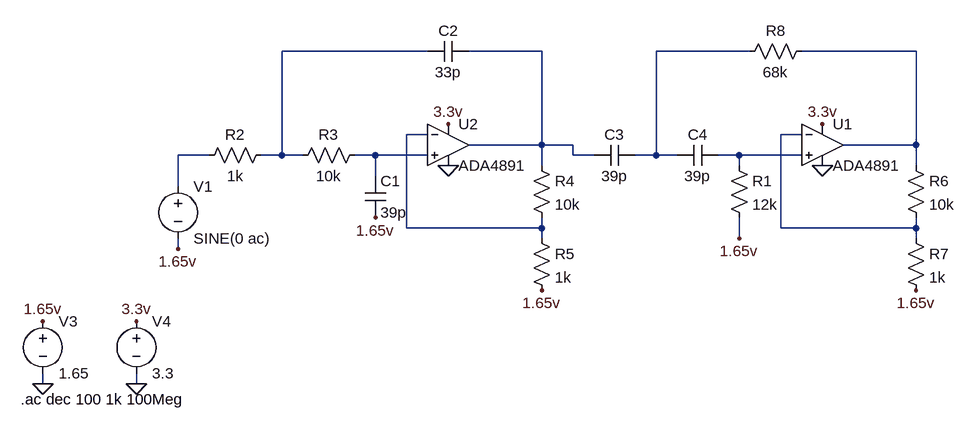
[diagram p0: schematic Draft5.asc]
Draft5.asc, the LTspice schematic file:
Version 4
SHEET 1 1140 680
WIRE 320 -64 96 -64
WIRE 496 -64 384 -64
WIRE 816 -64 672 -64
WIRE 1072 -64 896 -64
WIRE 320 64 288 64
WIRE 896 64 864 64
WIRE 496 80 496 -64
WIRE 496 80 384 80
WIRE 544 80 496 80
WIRE 1072 80 1072 -64
WIRE 1072 80 960 80
WIRE -16 96 -64 96
WIRE 96 96 96 -64
WIRE 96 96 64 96
WIRE 128 96 96 96
WIRE 240 96 208 96
WIRE 320 96 240 96
WIRE 544 96 544 80
WIRE 576 96 544 96
WIRE 672 96 672 -64
WIRE 672 96 640 96
WIRE 704 96 672 96
WIRE 800 96 768 96
WIRE 896 96 800 96
WIRE 496 112 496 80
WIRE 800 112 800 96
WIRE 1072 112 1072 80
WIRE 240 128 240 96
WIRE -64 144 -64 96
WIRE 288 208 288 64
WIRE 496 208 496 192
WIRE 496 208 288 208
WIRE 864 208 864 64
WIRE 1072 208 1072 192
WIRE 1072 208 864 208
WIRE 496 224 496 208
WIRE 800 224 800 192
WIRE 1072 224 1072 208
WIRE -64 240 -64 224
WIRE -272 448 -272 432
WIRE -128 448 -128 432
FLAG -272 448 0
FLAG -128 352 3.3v
FLAG -272 352 1.65v
FLAG -128 448 0
FLAG 352 112 0
FLAG 352 48 3.3v
FLAG 240 192 1.65v
FLAG 496 304 1.65v
FLAG 928 112 0
FLAG 928 48 3.3v
FLAG 800 224 1.65v
FLAG 1072 304 1.65v
FLAG -64 240 1.65v
SYMBOL voltage -272 336 R0
WINDOW 123 0 0 Left 0
WINDOW 39 0 0 Left 0
SYMATTR InstName V3
SYMATTR Value 1.65
SYMBOL voltage -128 336 R0
WINDOW 123 0 0 Left 0
WINDOW 39 0 0 Left 0
SYMATTR InstName V4
SYMATTR Value 3.3
SYMBOL OpAmps\\ADA4891 352 16 R0
SYMATTR InstName U2
SYMBOL res 80 80 R90
WINDOW 0 0 56 VBottom 2
WINDOW 3 32 56 VTop 2
SYMATTR InstName R2
SYMATTR Value 1k
SYMBOL res 224 80 R90
WINDOW 0 0 56 VBottom 2
WINDOW 3 32 56 VTop 2
SYMATTR InstName R3
SYMATTR Value 10k
SYMBOL cap 224 128 R0
SYMATTR InstName C1
SYMATTR Value 39p
SYMBOL cap 384 -80 R90
WINDOW 0 0 32 VBottom 2
WINDOW 3 32 32 VTop 2
SYMATTR InstName C2
SYMATTR Value 33p
SYMBOL res 480 96 R0
SYMATTR InstName R4
SYMATTR Value 10k
SYMBOL res 480 208 R0
SYMATTR InstName R5
SYMATTR Value 1k
SYMBOL OpAmps\\ADA4891 928 16 R0
SYMATTR InstName U1
SYMBOL res 1056 96 R0
SYMATTR InstName R6
SYMATTR Value 10k
SYMBOL res 1056 208 R0
SYMATTR InstName R7
SYMATTR Value 1k
SYMBOL cap 640 80 R90
WINDOW 0 0 32 VBottom 2
WINDOW 3 32 32 VTop 2
SYMATTR InstName C3
SYMATTR Value 39p
SYMBOL cap 768 80 R90
WINDOW 0 0 32 VBottom 2
WINDOW 3 32 32 VTop 2
SYMATTR InstName C4
SYMATTR Value 39p
SYMBOL res 784 96 R0
SYMATTR InstName R1
SYMATTR Value 12k
SYMBOL res 912 -80 R90
WINDOW 0 0 56 VBottom 2
WINDOW 3 32 56 VTop 2
SYMATTR InstName R8
SYMATTR Value 68k
SYMBOL voltage -64 128 R0
WINDOW 123 0 0 Left 0
WINDOW 39 0 0 Left 0
SYMATTR InstName V1
SYMATTR Value SINE(0 ac)
TEXT -306 472 Left 2 !.ac dec 100 1k 100Meg

The netlist it stands for:
* Draft5.asc
V3 1.65v 0 1.65
V4 3.3v 0 3.3
XU2 N008 N005 3.3v 0 N002 ADA4891-1  ; pins In+ In- V+ V- OUT
R2 N001 N007 1k
R3 N008 N001 10k
C1 N008 1.65v 39p
C2 N002 N001 33p
R4 N002 N005 10k
R5 N005 1.65v 1k
XU1 N009 N006 3.3v 0 N004 ADA4891-1  ; pins In+ In- V+ V- OUT
R6 N004 N006 10k
R7 N006 1.65v 1k
C3 N003 N002 39p
C4 N009 N003 39p
R1 N009 1.65v 12k
R8 N004 N003 68k
V1 N007 1.65v SINE(0 ac)
.ac dec 100 1k 100Meg
.lib ADA4891-1.lib
.backanno
.end